# Altium project MPU6050.PrjPcb
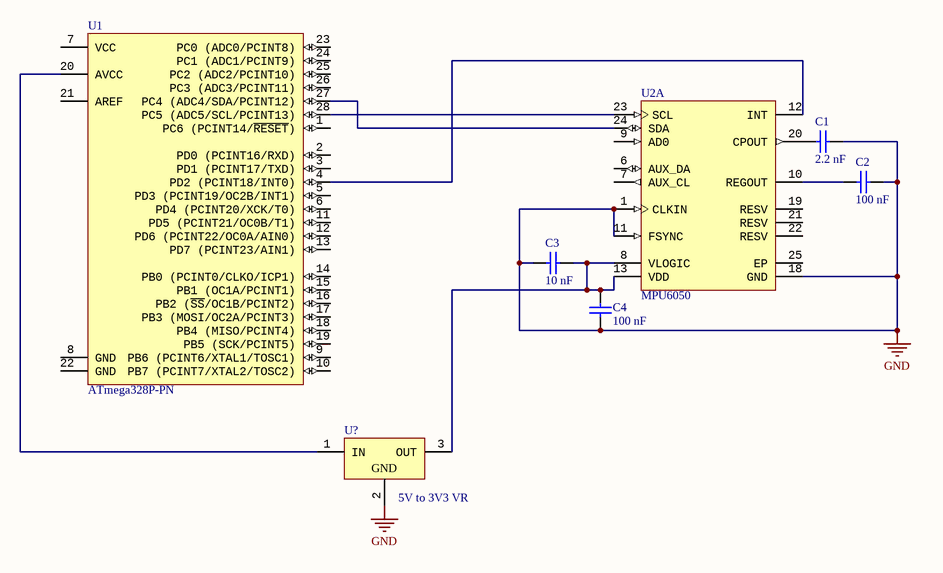
[diagram p0: Sheet1.SchDoc]
1 sheet, 7 parts. Net scope: global (net labels, ports and power ports of the same name join across sheets).

## Sheet Sheet1.SchDoc: ENTER SHEET TITLE
size B; Engineer: ENTER ENGINEER NAME; Organization: CUAir; Address1: L3, 12a Rodborough Rd; Address2: Frenchs Forest; Address3: NSW; Address4: Australia 2086; Revision: ENTER REVISION NUMBER; CompetitionYear: 2019; CPN: ENTER CPN; PROJECT: ENTER PROJECT NAME

### Parts
C1  2.2 nF  [CAPC0805(2012)100_M]
C2  100 nF  [CAPC0805(2012)145_M]
C3  10 nF  [CAPC0805(2012)100_M]
C4  100 nF  [CAPC0805(2012)145_M]
U1  ATmega328P-PN  [28P3]
U2  MPU6050  [INSE-QFN-24_V]  (part A of 2)
U?  5V to 3V3 VR  [T03B]

### Nets
GND: C1.2 C2.2 C3.1 C4.1 U2.1(CLKIN) U2.11(FSYNC) U2.18(GND) U?.2(GND)
NetC1_1: C1.1 U2.20(CPOUT)
NetC2_1: C2.1 U2.10(REGOUT)
NetC3_2: C3.2 C4.2 U2.8(VLOGIC) U2.13(VDD) U?.3(OUT)
NetU1_4: U1.4(PD2_(PCINT18/INT0)) U2.12(INT)
NetU1_20: U1.20(AVCC) U?.1(IN)
NetU1_27: U1.27(PC4_(ADC4/SDA/PCINT12)) U2.24(SDA)
NetU1_28: U1.28(PC5_(ADC5/SCL/PCINT13)) U2.23(SCL)

Not connected (* = marked no-connect by the designer): U1 1(PC6_(PCINT14/~{RESET})) 2(PD0_(PCINT16/RXD)) 3(PD1_(PCINT17/TXD)) 5(PD3_(PCINT19/OC2B/INT1)) 6(PD4_(PCINT20/XCK/T0)) 7(VCC) 8(GND) 9(PB6_(PCINT6/XTAL1/TOSC1)) 10(PB7_(PCINT7/XTAL2/TOSC2)) 11(PD5_(PCINT21/OC0B/T1)) 12(PD6_(PCINT22/OC0A/AIN0)) 13(PD7_(PCINT23/AIN1)) 14(PB0_(PCINT0/CLKO/ICP1)) 15(PB1_(OC1A/PCINT1)) 16(PB2_(~{SS}/OC1B/PCINT2)) 17(PB3_(MOSI/OC2A/PCINT3)) 18(PB4_(MISO/PCINT4)) 19(PB5_(SCK/PCINT5)) 21(AREF) 22(GND) 23(PC0_(ADC0/PCINT8)) 24(PC1_(ADC1/PCINT9)) 25(PC2_(ADC2/PCINT10)) 26(PC3_(ADC3/PCINT11)); U2 6(AUX_DA) 7(AUX_CL) 9(AD0) 19(RESV) 21(RESV) 22(RESV) 25(EP)

### Notes on the sheet
- Project
- Title
- Size:
- Date:
- B
- Number:
- Revision:
- File:

### Library data of the parts
C1 = CMP-1036-03244-1: CAP 2.2nF 16V ±5% 0805 (2012 Metric) Thickness 1mm SMD; Case-EIA: 0805; Tolerance: Â±5%; Case-Metric: 2012; Value: 2.2nF; Rated Voltage: 16 V; Max Thickness: 1 mm; Technology: SMT
C2 C4 = CMP-1036-04413-1: CAP 100nF 25V ±20% 0805 (2012 Metric) Thickness 1.45mm SMD; Case-Metric: 2012; Case-EIA: 0805; Tolerance: Â±20%; Value: 100nF; Rated Voltage: 25 V; Max Thickness: 1.45 mm; Technology: SMT
C3 = CMP-1036-03801-1: CAP 10nF 6.3V ±5% 0805 (2012 Metric) Thickness 1mm SMD; Case-EIA: 0805; Tolerance: Â±5%; Case-Metric: 2012; Value: 10nF; Rated Voltage: 6.3 V; Max Thickness: 1 mm; Technology: SMT
U1 = CMP-0095-00355-1: 8-bit AVR Microcontroller, 32KB Flash, 1KB EEPROM, 2KB SRAM, 28-pin PDIP, Industrial Grade (-40°C to 105°C); PackageVersion: revB, Sep-2001; ComponentLink1Description: Manufacturer URL; ComponentLink1URL: http://www.atmel.com/; ComponentLink2URL: http://www.atmel.com/dyn/resources/prod_documents/8271.pdf; PackageDescription: 28-lead (0.300"/7.62mm Wide) Plastic Dual Inline Package (PDIP); ComponentLink2Description: ATmega48A/48PA/88A/88PA/168A/168PA/328/328P Datasheet; ComponentLink3Description: ATmega48A/48PA/88A/88PA/168A/168PA/328/328P Summary; DatasheetVersion: revD, May-2011; ComponentLink3URL: http://www.atmel.com/dyn/resources/prod_documents/8271S.pdf; PackageReference: 28P3
U2 = CMP-1753-00002-1: 3-Axis Gyroscope, 3-Axis Accelerometer / , 2.375 to 3.46 V, -40 to 105 degC, 24-Pin QFN, RoHS, Tape and Reel; Resistance: 5.6 kohm; Tolerance: 1%; Voltage Rating: 75 V; Power Rating: 100 mW; ComponentLink1Description: Manufacturer URL; Mount: Surface Mount; Max Operating Temperature: 155degC; Package Quantity: 5000; ComponentLink2Description: Datasheet; Pins: 2; Packaging: Tape and Reel; Case Code (Imperial): 0603; PackageReference: QFN-24; ComponentLink2URL: https://datasheet.ciiva.com/1513/1788002-1513632.pdf; Radiation Hardening: No; ComponentLink1URL: http://www.invensense.com/; PackageDescription: 24-Pin Quad Flat No-lead Package, Body 4 x 4 mm, Pitch 0.5 mm; Height: 0.45 mm; Case/Package: 0603; Case Code (Metric): 1608; REACH SVHC: Yes; Min Operating Temperature: -55degC; DatasheetVersion: Rev. 3.4, 08/2013; Width: 0.8 mm; RoHSCompliant: True; Length: 1.6 mm
U? = CMP-0062-02467-2: 1A Low Dropout Regulator for 5V to 3.3V Conversion, 3-pin TO-220, Pb-Free; Manufacturer: National Semiconductor; PackageTopMarking: NSUZXYTTE#*LM3940IT*-3.3 P+; PowerWise: N; CompType: LDO IC; ComponentLink2URL: http://www.national.com/pf/LM/LM3940.html; ComponentLink1URL: http://www.national.com/ds/LM/LM3940.pdf; PinCount: 3; ComponentLink3URL: http://www.national.com/packaging/folders/t03b.html; ComponentLink1Description: LM3940 Datasheet; ComponentLink3Description: T03B Package Page; RoHS: Y; ComponentLink2Description: LM3940 Web Page; PackageVersion: revL, Jan-1992; RevisionNote: Component URLs added; DatasheetVersion: Jul-2007; PackageReference: T03B; PackageDescription: TO-220, Molded, 3 Lead, Straight